# EAGLE design business_card_v1 (EAGLE 9.5.2)
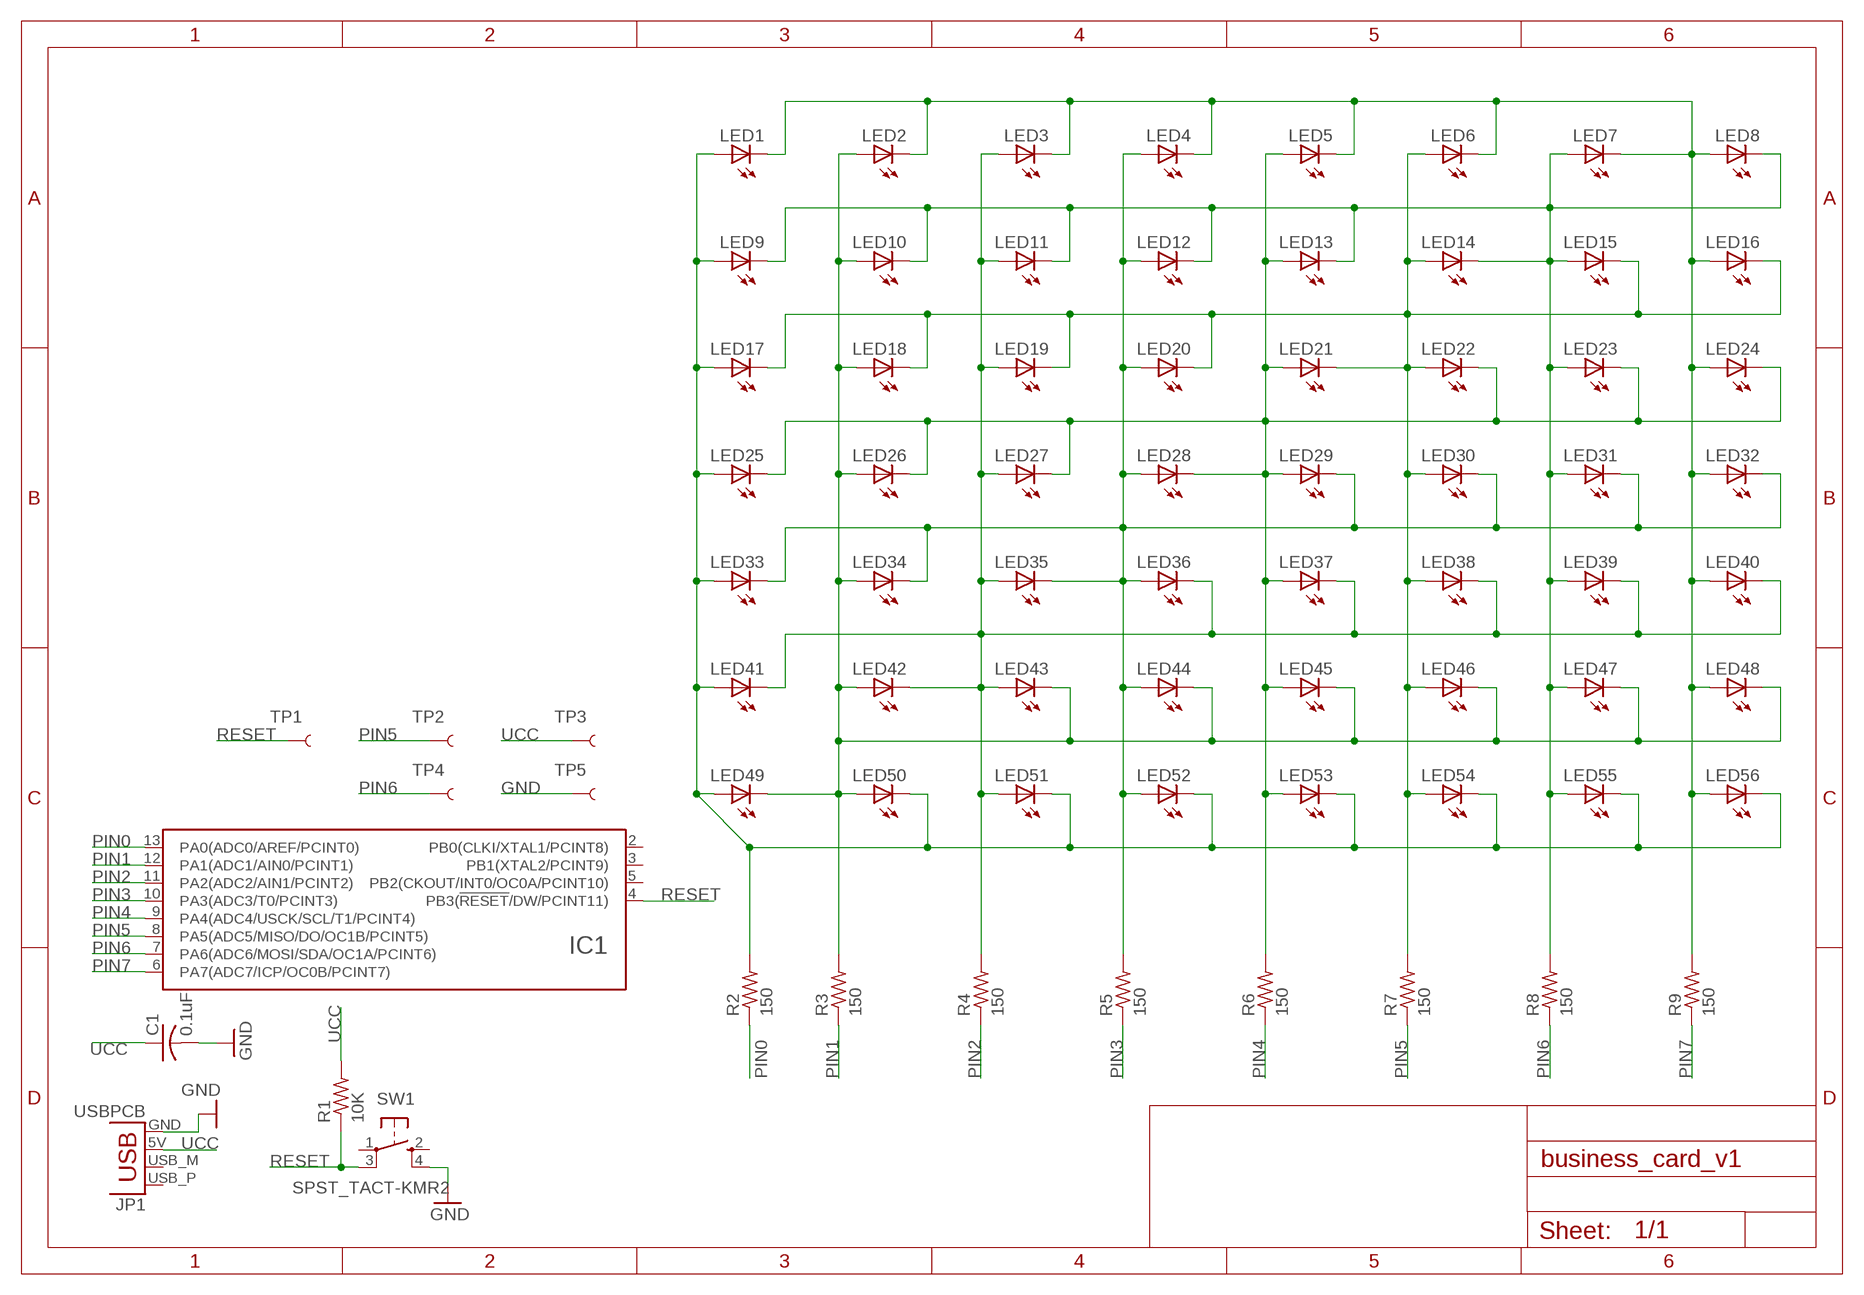
[diagram p0: schematic, sheet 1]

## Parts
C1  0.1uF  C-USC0603K  [C0603K]
IC1  ATTINY24/44/84-SSU  [SOIC14]
JP1  USBPCB  [USB-A-PCB]
LED1  LEDCHIPLED_0805  [CHIPLED_0805]
LED2  LEDCHIPLED_0805  [CHIPLED_0805]
LED3  LEDCHIPLED_0805  [CHIPLED_0805]
LED4  LEDCHIPLED_0805  [CHIPLED_0805]
LED5  LEDCHIPLED_0805  [CHIPLED_0805]
LED6  LEDCHIPLED_0805  [CHIPLED_0805]
LED7  LEDCHIPLED_0805  [CHIPLED_0805]
LED8  LEDCHIPLED_0805  [CHIPLED_0805]
LED9  LEDCHIPLED_0805  [CHIPLED_0805]
LED10  LEDCHIPLED_0805  [CHIPLED_0805]
LED11  LEDCHIPLED_0805  [CHIPLED_0805]
LED12  LEDCHIPLED_0805  [CHIPLED_0805]
LED13  LEDCHIPLED_0805  [CHIPLED_0805]
LED14  LEDCHIPLED_0805  [CHIPLED_0805]
LED15  LEDCHIPLED_0805  [CHIPLED_0805]
LED16  LEDCHIPLED_0805  [CHIPLED_0805]
LED17  LEDCHIPLED_0805  [CHIPLED_0805]
LED18  LEDCHIPLED_0805  [CHIPLED_0805]
LED19  LEDCHIPLED_0805  [CHIPLED_0805]
LED20  LEDCHIPLED_0805  [CHIPLED_0805]
LED21  LEDCHIPLED_0805  [CHIPLED_0805]
LED22  LEDCHIPLED_0805  [CHIPLED_0805]
LED23  LEDCHIPLED_0805  [CHIPLED_0805]
LED24  LEDCHIPLED_0805  [CHIPLED_0805]
LED25  LEDCHIPLED_0805  [CHIPLED_0805]
LED26  LEDCHIPLED_0805  [CHIPLED_0805]
LED27  LEDCHIPLED_0805  [CHIPLED_0805]
LED28  LEDCHIPLED_0805  [CHIPLED_0805]
LED29  LEDCHIPLED_0805  [CHIPLED_0805]
LED30  LEDCHIPLED_0805  [CHIPLED_0805]
LED31  LEDCHIPLED_0805  [CHIPLED_0805]
LED32  LEDCHIPLED_0805  [CHIPLED_0805]
LED33  LEDCHIPLED_0805  [CHIPLED_0805]
LED34  LEDCHIPLED_0805  [CHIPLED_0805]
LED35  LEDCHIPLED_0805  [CHIPLED_0805]
LED36  LEDCHIPLED_0805  [CHIPLED_0805]
LED37  LEDCHIPLED_0805  [CHIPLED_0805]
LED38  LEDCHIPLED_0805  [CHIPLED_0805]
LED39  LEDCHIPLED_0805  [CHIPLED_0805]
LED40  LEDCHIPLED_0805  [CHIPLED_0805]
LED41  LEDCHIPLED_0805  [CHIPLED_0805]
LED42  LEDCHIPLED_0805  [CHIPLED_0805]
LED43  LEDCHIPLED_0805  [CHIPLED_0805]
LED44  LEDCHIPLED_0805  [CHIPLED_0805]
LED45  LEDCHIPLED_0805  [CHIPLED_0805]
LED46  LEDCHIPLED_0805  [CHIPLED_0805]
LED47  LEDCHIPLED_0805  [CHIPLED_0805]
LED48  LEDCHIPLED_0805  [CHIPLED_0805]
LED49  LEDCHIPLED_0805  [CHIPLED_0805]
LED50  LEDCHIPLED_0805  [CHIPLED_0805]
LED51  LEDCHIPLED_0805  [CHIPLED_0805]
LED52  LEDCHIPLED_0805  [CHIPLED_0805]
LED53  LEDCHIPLED_0805  [CHIPLED_0805]
LED54  LEDCHIPLED_0805  [CHIPLED_0805]
LED55  LEDCHIPLED_0805  [CHIPLED_0805]
LED56  LEDCHIPLED_0805  [CHIPLED_0805]
R1  10K  R-US_R0603  [R0603]
R2  150  R-US_R0603  [R0603]
R3  150  R-US_R0603  [R0603]
R4  150  R-US_R0603  [R0603]
R5  150  R-US_R0603  [R0603]
R6  150  R-US_R0603  [R0603]
R7  150  R-US_R0603  [R0603]
R8  150  R-US_R0603  [R0603]
R9  150  R-US_R0603  [R0603]
SW1  SPST_TACT-KMR2  [KMR2]
TP1  TEST-POINTPOGO_PTH  [1X01_NO_SILK]
TP2  TEST-POINTPOGO_PTH  [1X01_NO_SILK]
TP3  TEST-POINTPOGO_PTH  [1X01_NO_SILK]
TP4  TEST-POINTPOGO_PTH  [1X01_NO_SILK]
TP5  TEST-POINTPOGO_PTH  [1X01_NO_SILK]

## Nets
GND: C1.2 JP1.GND SW1.4(S1) TP5.1
N$1: LED1.A LED9.A LED17.A LED25.A LED33.A LED41.A LED49.A LED50.C LED51.C LED52.C LED53.C LED54.C LED55.C LED56.C R2.2
N$2: LED2.A LED10.A LED18.A LED26.A LED34.A LED42.A LED43.C LED44.C LED45.C LED46.C LED47.C LED48.C LED49.C LED50.A R3.2
N$3: LED3.A LED11.A LED19.A LED27.A LED35.A LED36.C LED37.C LED38.C LED39.C LED40.C LED41.C LED42.C LED43.A LED51.A R4.2
N$4: LED4.A LED12.A LED20.A LED28.A LED29.C LED30.C LED31.C LED32.C LED33.C LED34.C LED35.C LED36.A LED44.A LED52.A R5.2
N$8: LED1.C LED2.C LED3.C LED4.C LED5.C LED6.C LED7.C LED8.A LED16.A LED24.A LED32.A LED40.A LED48.A LED56.A R9.2
N$15: LED7.A LED8.C LED9.C LED10.C LED11.C LED12.C LED13.C LED14.C LED15.A LED23.A LED31.A LED39.A LED47.A LED55.A R8.2
N$31: LED6.A LED14.A LED15.C LED16.C LED17.C LED18.C LED19.C LED20.C LED21.C LED22.A LED30.A LED38.A LED46.A LED54.A R7.2
N$34: LED5.A LED13.A LED21.A LED22.C LED23.C LED24.C LED25.C LED26.C LED27.C LED28.C LED29.A LED37.A LED45.A LED53.A R6.2
PIN0: IC1.13(PA0(ADC0/AREF/PCINT0)) R2.1
PIN1: IC1.12(PA1(ADC1/AIN0/PCINT1)) R3.1
PIN2: IC1.11(PA2(ADC2/AIN1/PCINT2)) R4.1
PIN3: IC1.10(PA3(ADC3/T0/PCINT3)) R5.1
PIN4: IC1.9(PA4(ADC4/USCK/SCL/T1/PCINT4)) R6.1
PIN5: IC1.8(PA5(ADC5/MISO/DO/OC1B/PCINT5)) R7.1 TP2.1
PIN6: IC1.7(PA6(ADC6/MOSI/SDA/OC1A/PCINT6)) R8.1 TP4.1
PIN7: IC1.6(PA7(ADC7/ICP/OC0B/PCINT7)) R9.1
RESET: IC1.4(PB3(!RESET!/DW/PCINT11)) R1.1 SW1.3(P1) TP1.1
UCC: C1.1 JP1.5V(VBUS) R1.2 TP3.1
Unconnected: IC1.2(PB0(CLKI/XTAL1/PCINT8)) IC1.3(PB1(XTAL2/PCINT9)) IC1.5(PB2(CKOUT/INT0/OC0A/PCINT10)) JP1.USB_M(D-) JP1.USB_P(D+) SW1.1(P) SW1.2(S)

## Power pins joined to a net without a drawn wire
GND: IC1.14(GND)
UCC: IC1.1(UCC)

## Library data of the parts
C1 = adafruit:C-US: CAPACITOR, American symbol
IC1 = atmel_tiny24-44-84tiny48-88mega48-88-168-328:ATTINY24/44/84
JP1 = SparkFun-Connectors:USB: USB Connectors USB-B-PTH is fully proven SKU : PRT-00139/CONN-08278 USB-miniB is fully proven SKU : PRT-00587 USB-A-PCB is untested. USB-A-H is throughly reviewed, but untested. Spark Fun Electronics SKU : PRT-00437 USB-B-SMT is throughly reviewed, but untested. Needs silkscreen touching up. USB-A-S has not been used/tested USB-MB-H has not been used/tested USB-MICROB has been used. CONN-09505
LED1-LED56 = led:LED: LED OSRAM: - CHIPLED LG R971, LG N971, LY N971, LG Q971, LY Q971, LO R971, LY R971 LH N974, LH R974 LS Q976, LO Q976, LY Q976 LO Q996 - Hyper CHIPLED LW Q18S LB Q993, LB Q99A, LB R99A - SideLED LS A670, LO A670, LY A670, LG A670, LP A670 LB A673, LV A673, LT A673, LW A673 LH A674 LY A675 LS A676, LA A676, LO A676, LY A676, LW A676 LS A679, LY A679, LG A679 - Hyper Micro SIDELED® LS Y876, LA Y876, LO Y876, LY Y876 LT Y87S - SmartLED LW L88C, LW L88S LB L89C, LB L89S, LG L890 LS L89K, LO L89K, LY L89K LS L896, LA L896, LO L896, LY L896 - TOPLED LS T670, LO T670, LY T670, LG T670, LP T670 LSG T670, LSP T670, LSY T670, LOP T670, LYG T670 LG T671, LOG T671, LSG T671 LB T673, LV T673, LT T673, LW T673 LH T674 LS T676, LA T676, LO T676, LY T676, LB T676, LH T676, LSB T676, LW T676 LB T67C, LV T67C, LT T67C, LS T67K, LO T67K, LY T67K, LW E67C LS E67B, LA E67B, LO E67B, LY E67B, LB E67C, LV E67C, LT E67C LW T67C LS T679, LY T679, LG T679 LS T770, LO T770, LY T770, LG T770, LP T770 LB T773, LV T773, LT T773, LW T773 LH T774 LS E675, LA E675, LY E675, LS T675 LS T776, LA T776, LO T776, LY T776, LB T776 LHGB T686 LT T68C, LB T68C - Hyper Mini TOPLED® LB M676 - Mini TOPLED Santana® LG M470 LS M47K, LO M47K, LY M47K Source: http://www.osram.convergy.de LUXEON: - LUMILED® LXK2-PW12-R00, LXK2-PW12-S00, LXK2-PW14-U00, LXK2-PW14-V00 LXK2-PM12-R00, LXK2-PM12-S00, LXK2-PM14-U00 LXK2-PE12-Q00, LXK2-PE12-R00, LXK2-PE12-S00, LXK2-PE14-T00, LXK2-PE14-U00 LXK2-PB12-K00, LXK2-PB12-L00, LXK2-PB12-M00, LXK2-PB14-N00, LXK2-PB14-P00, LXK2-PB14-Q00 LXK2-PR12-L00, LXK2-PR12-M00, LXK2-PR14-Q00, LXK2-PR14-R00 LXK2-PD12-Q00, LXK2-PD12-R00, LXK2-PD12-S00 LXK2-PH12-R00, LXK2-PH12-S00 LXK2-PL12-P00, LXK2-PL12-Q00, LXK2-PL12-R00 Source: www.luxeon.com KINGBRIGHT: KA-3528ASYC Source: www.kingbright.com
R1-R9 = resistor:R-US_: RESISTOR, American symbol
SW1 = adafruit:SPST_TACT: SMT 6mm switch, EVQQ2 series http://www.ladyada.net/library/eagle
TP1-TP5 = SparkFun-Connectors:TEST-POINT: SparkFun Test Points Bare copper test points for troubleshooting or In-Circuit-Testing. These are used by our Production team for verifying production board runs using pogo-pins on test beds. SparkFun Products: SparkFun LSM9DS1 Breakout <https://www.sparkfun.com/products/13284> SparkFun PSOC <https://www.sparkfun.com/products/13714> SparkFun Load Cell Amplifier <https://www.sparkfun.com/products/13879>

## Board
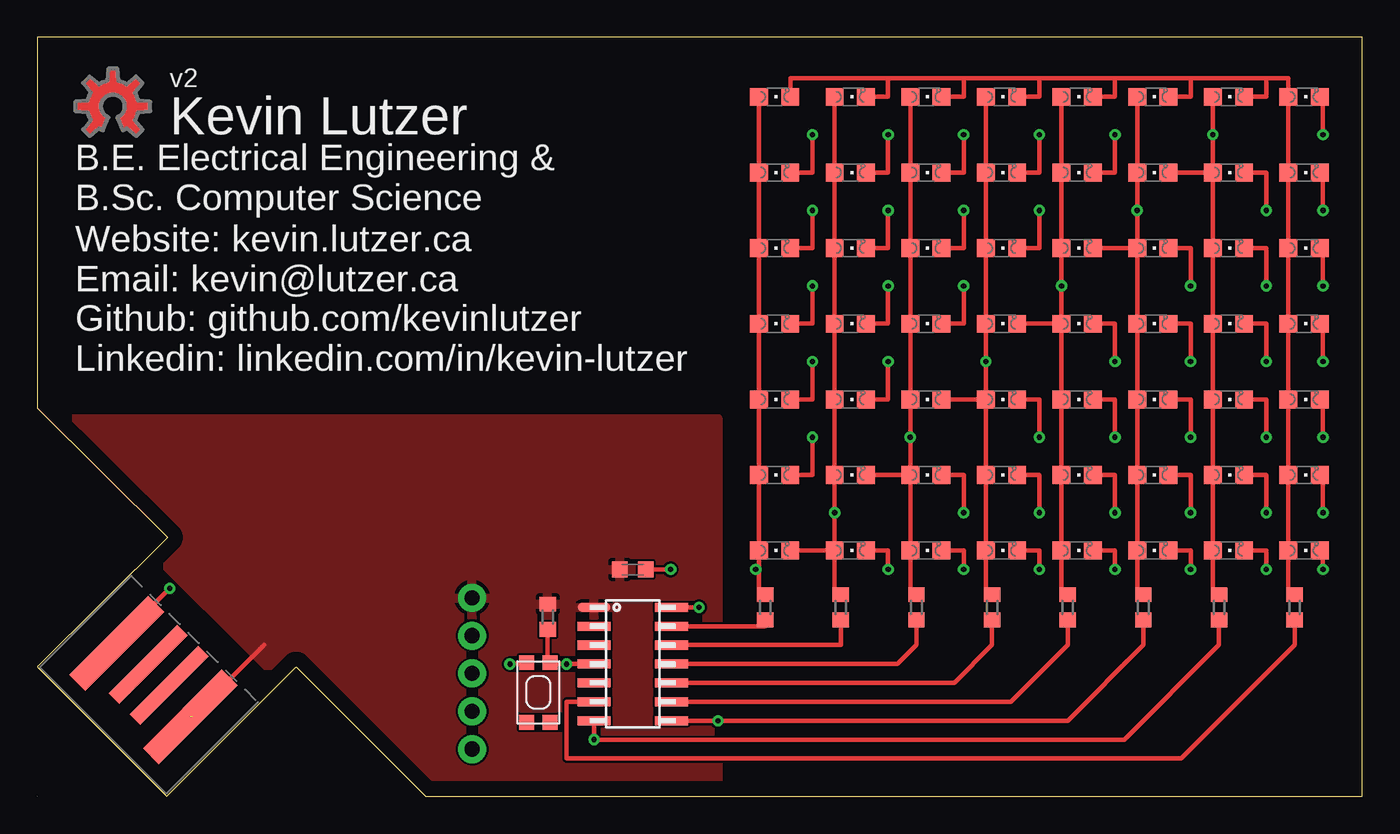
[diagram p1: board, top side]
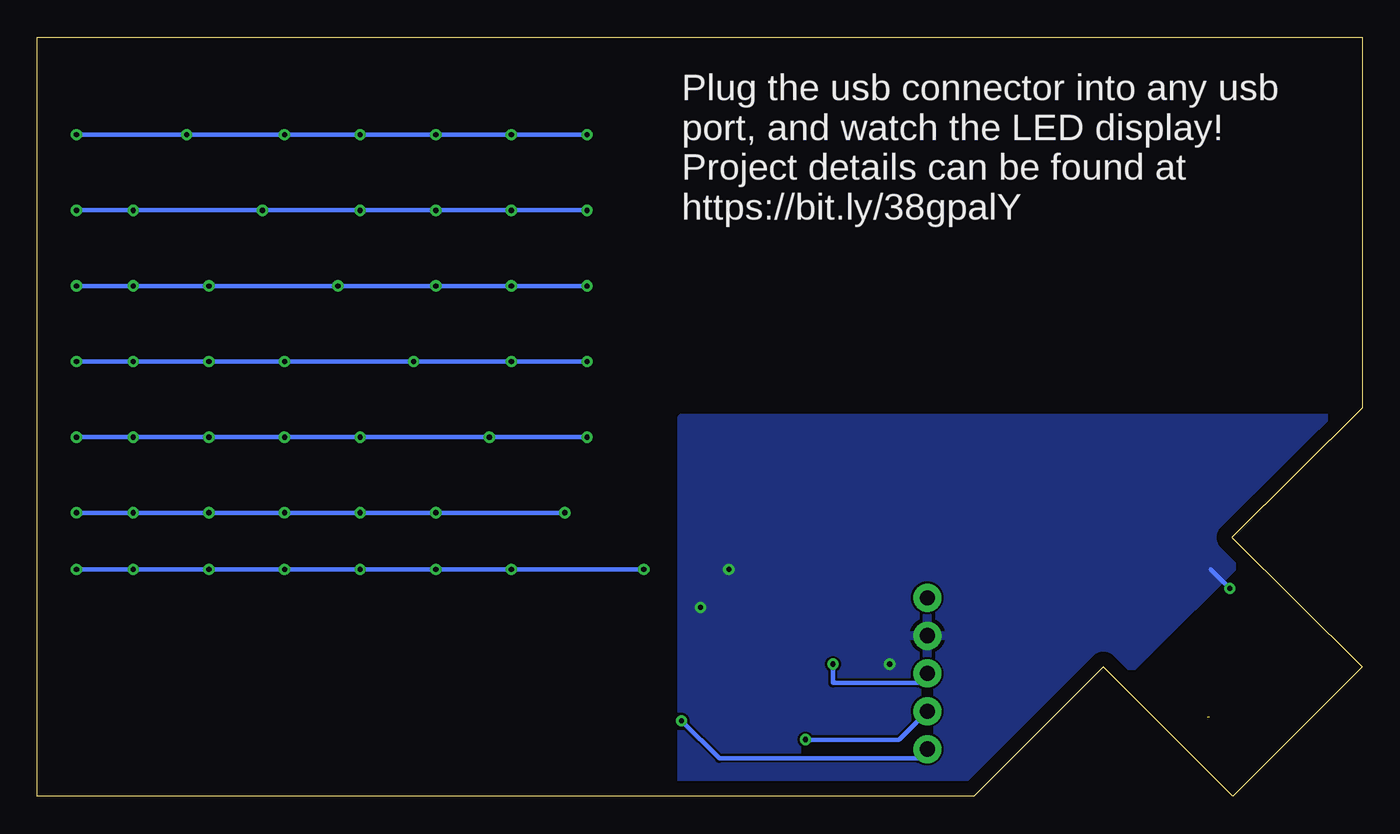
[diagram p2: board, bottom side, seen from below]

Size 89 x 51 mm. Coordinates in mm from the lower left corner, seen from the top.
Outline: 0,51 0,26.09 8.77,17.39 0,8.7 8.7,0 17.39,8.7 26.09,0 89,0 89,51 0,51
Copper layers (1*16): Top 0.035mm / dielectric 1.5mm / Bottom 0.035mm
Design rules "default": minimum track width 6mil, minimum drill 0.35mm, track to track 6mil, track to pad 6mil, pad to pad 6mil, via to via 6mil, smd to smd 6mil, copper to edge 40mil, drill to drill 6mil, minimum pad ring 10mil, minimum via ring 8mil, stop-mask expansion 4mil, vias tented up to drill 0mil, thermal gap 10mil

### Footprints (pad centres in the part's own frame; a part is rotated, then mirrored left to right if it is on the bottom)
C0603K = smd 1.05 x 1.08: 1 -0.875,0; 2 0.875,0
SOIC14 = smd 0.61 x 2.21: 1 -3.81,-2.603; 2 -2.54,-2.603; 3 -1.27,-2.603; 4 0,-2.603; 5 1.27,-2.603; 6 2.54,-2.603; 7 3.81,-2.603; 8 3.81,2.603; 9 2.54,2.603; 10 1.27,2.603; 11 0,2.603; 12 -1.27,2.603; 13 -2.54,2.603; 14 -3.81,2.603
USB-A-PCB = smd 7.5 x 1.5: 5V -0.2,-3.5; GND -0.2,3.5 | smd 6.5 x 1: USB_M 0.3,-1; USB_P 0.3,1
CHIPLED_0805 = smd 1.2 x 1.2: A 0,-1.05; C 0,1.05
R0603 = smd 1 x 1.1: 1 -0.85,0; 2 0.85,0
KMR2 = smd 1 x 1: 1 2,0.8; 2 2,-0.8; 3 -2,0.8; 4 -2,-0.8
1X01_NO_SILK = drill 1.016 pad 1.88: 1 0,0

### Placement (x,y rotation side)
C1  40.01,15.24 0 top
IC1  40.01,8.89 270 top
JP1  7.95,7.95 45 top
LED1  49.53,46.99 270 top
LED2  54.61,46.99 270 top
LED3  59.69,46.99 270 top
LED4  64.77,46.99 270 top
LED5  69.85,46.99 270 top
LED6  74.93,46.99 270 top
LED7  80.01,46.99 270 top
LED8  85.09,46.99 270 top
LED9  49.53,41.91 270 top
LED10  54.61,41.91 270 top
LED11  59.69,41.91 270 top
LED12  64.77,41.91 270 top
LED13  69.85,41.91 270 top
LED14  74.93,41.91 270 top
LED15  80.01,41.91 270 top
LED16  85.09,41.91 270 top
LED17  49.53,36.83 270 top
LED18  54.61,36.83 270 top
LED19  59.69,36.83 270 top
LED20  64.77,36.83 270 top
LED21  69.85,36.83 270 top
LED22  74.93,36.83 270 top
LED23  80.01,36.83 270 top
LED24  85.09,36.83 270 top
LED25  49.53,31.75 270 top
LED26  54.61,31.75 270 top
LED27  59.69,31.75 270 top
LED28  64.77,31.75 270 top
LED29  69.85,31.75 270 top
LED30  74.93,31.75 270 top
LED31  80.01,31.75 270 top
LED32  85.09,31.75 270 top
LED33  49.53,26.67 270 top
LED34  54.61,26.67 270 top
LED35  59.69,26.67 270 top
LED36  64.77,26.67 270 top
LED37  69.85,26.67 270 top
LED38  74.93,26.67 270 top
LED39  80.01,26.67 270 top
LED40  85.09,26.67 270 top
LED41  49.53,21.59 270 top
LED42  54.61,21.59 270 top
LED43  59.69,21.59 270 top
LED44  64.77,21.59 270 top
LED45  69.85,21.59 270 top
LED46  74.93,21.59 270 top
LED47  80.01,21.59 270 top
LED48  85.09,21.59 270 top
LED49  49.53,16.51 270 top
LED50  54.61,16.51 270 top
LED51  59.69,16.51 270 top
LED52  64.77,16.51 270 top
LED53  69.85,16.51 270 top
LED54  74.93,16.51 270 top
LED55  80.01,16.51 270 top
LED56  85.09,16.51 270 top
R1  34.29,12.06 90 top
R2  48.9,12.7 90 top
R3  53.98,12.7 90 top
R4  59.05,12.7 90 top
R5  64.14,12.7 90 top
R6  69.22,12.7 90 top
R7  74.3,12.7 90 top
R8  79.38,12.7 90 top
R9  84.45,12.7 90 top
SW1  33.66,6.99 270 top
TP1  29.21,8.26 0 top
TP2  29.21,3.17 0 top
TP3  29.21,13.34 0 top
TP4  29.21,5.71 0 top
TP5  29.21,10.79 0 top
U$1  [OSHWLOGO_TOP_0.2]  5.08,46.35 0 top

### Tracks (layer width: path | path; a pad name or v marks a point on that pad's centre or on a via)
GND  (via drill 0.35)
  Top 0.305: SW1.4 32.76,8.89 v31.75,8.89 | C1.2 v42.55,15.24 | IC1.14 v44.45,12.7 | 5.33,10.41 v8.89,13.97
  Top 0.813: 5.33,10.41 JP1.GND
  Bottom 0.305: v8.89,13.97 10.16,15.24
  pour Bottom: -1.27,25.4 45.72,25.4 45.72,0 24.13,0
N$1  (via drill 0.35)
  Top 0.305: LED41.A LED49.A 48.48,15.24 | LED41.A LED25.A | LED1.A LED9.A LED25.A | 48.48,15.24 v48.26,15.24 | LED50.C 57.15,16.51 v57.15,15.24 | LED51.C 62.23,16.51 v62.23,15.24 | LED52.C 67.31,16.51 v67.31,15.24 | LED53.C 72.39,16.51 v72.39,15.24 | LED54.C 77.47,16.51 v77.47,15.24 | LED55.C 82.55,16.51 v82.55,15.24 | R2.2 48.48,13.55 48.48,15.24 | LED33.A LED41.A | LED17.A LED25.A | LED56.C 86.36,16.29 v86.36,15.24
  Bottom 0.305: v86.36,15.24 v82.55,15.24 v77.47,15.24 v72.39,15.24 v67.31,15.24 v62.23,15.24 v57.15,15.24 v48.26,15.24
N$2  (via drill 0.35)
  Top 0.305: LED50.A v53.56,19.05 LED42.A LED26.A | v86.36,19.05 86.36,21.59 LED48.C | LED49.C LED50.A | LED43.C 62.23,21.59 v62.23,19.05 | LED44.C 67.31,21.59 v67.31,19.05 | LED45.C 72.39,21.59 v72.39,19.05 | LED46.C 77.47,21.59 v77.47,19.05 | LED47.C 82.55,21.59 v82.55,19.05 | LED50.A 53.56,13.55 R3.2 | LED2.A LED10.A LED18.A LED26.A | LED34.A LED26.A
  Bottom 0.305: v53.56,19.05 v62.23,19.05 v67.31,19.05 v72.39,19.05 v77.47,19.05 v82.55,19.05 v86.36,19.05
N$3  (via drill 0.35)
  Top 0.305: LED43.A LED51.A 58.64,13.55 R4.2 | LED35.A v58.64,24.13 LED43.A | LED35.A LED19.A | LED19.A LED3.A | LED41.C 52.07,21.59 v52.07,24.13 | v86.36,24.13 86.36,26.67 LED40.C | LED36.C 67.31,26.67 v67.31,24.13 | LED37.C 72.39,26.67 v72.39,24.13 | LED38.C 77.47,26.67 v77.47,24.13 | LED39.C 82.55,26.67 v82.55,24.13 | LED42.C LED43.A | LED11.A LED19.A | LED35.A LED43.A | LED27.A LED35.A
  Bottom 0.305: v52.07,24.13 v58.64,24.13 v67.31,24.13 v72.39,24.13 v77.47,24.13 v82.55,24.13 v86.36,24.13
N$4  (via drill 0.35)
  Top 0.305: LED4.A LED20.A | LED20.A v63.72,29.21 LED36.A | LED36.A LED52.A | LED33.C 52.07,26.67 v52.07,29.21 | v86.36,29.21 86.36,31.75 LED32.C | LED31.C 82.55,31.75 v82.55,29.21 | LED30.C 77.47,31.75 v77.47,29.21 | LED29.C 72.39,31.75 v72.39,29.21 | LED52.A 63.72,13.55 R5.2 | LED34.C 57.15,26.67 v57.15,29.21 | LED35.C LED36.A | LED28.A LED36.A | LED12.A LED20.A | LED44.A LED52.A
  Bottom 0.305: v52.07,29.21 v57.15,29.21 v63.72,29.21 v72.39,29.21 v77.47,29.21 v82.55,29.21 v86.36,29.21
N$8
  Top 0.305: LED56.A LED40.A LED32.A LED24.A LED16.A LED8.A 84.04,48.26 82.55,48.26 | LED1.C 50.58,48.26 57.15,48.26 | 82.55,48.26 77.47,48.26 | 77.47,48.26 72.39,48.26 | 72.39,48.26 67.31,48.26 | 67.31,48.26 62.23,48.26 | 62.23,48.26 57.15,48.26 | LED2.C 57.15,46.99 57.15,48.26 | LED3.C 62.23,46.99 62.23,48.26 | LED4.C 67.31,46.99 67.31,48.26 | LED5.C 72.39,46.99 72.39,48.26 | LED6.C 77.47,46.99 77.47,48.26 | LED7.C 82.55,46.99 82.55,48.26 | LED56.A 84.04,13.55 R9.2 | LED48.A LED56.A
N$15  (via drill 0.35)
  Top 0.305: LED31.A LED15.A | LED7.A v78.96,44.45 LED15.A | LED9.C 52.07,41.91 v52.07,44.45 | v86.36,44.45 86.36,46.99 LED8.C | LED10.C 57.15,41.91 v57.15,44.45 | LED11.C 62.23,41.91 v62.23,44.45 | LED12.C 67.31,41.91 v67.31,44.45 | LED13.C 72.39,41.91 v72.39,44.45 | LED14.C LED15.A | R8.2 78.96,13.55 LED55.A LED47.A LED39.A LED31.A | LED23.A LED31.A
  Bottom 0.305: v52.07,44.45 v57.15,44.45 v62.23,44.45 v67.31,44.45 v72.39,44.45 v78.96,44.45 v86.36,44.45
N$31  (via drill 0.35)
  Top 0.305: LED54.A LED38.A LED30.A LED22.A | LED17.C 52.07,36.83 v52.07,39.37 | v86.36,39.37 86.36,41.91 LED16.C | LED15.C 82.55,41.91 v82.55,39.37 | LED18.C 57.15,36.83 v57.15,39.37 | LED19.C 62.23,36.83 v62.23,39.37 | LED20.C 67.31,36.83 v67.31,39.37 | LED21.C LED22.A | LED54.A 73.88,13.55 R7.2 | LED6.A v73.88,39.37 LED22.A | LED14.A LED22.A | LED46.A LED54.A
  Bottom 0.305: v52.07,39.37 v57.15,39.37 v62.23,39.37 v67.31,39.37 v73.88,39.37 v82.55,39.37 v86.36,39.37
N$34  (via drill 0.35)
  Top 0.305: LED53.A LED37.A LED29.A | LED21.A v68.8,34.29 LED29.A | LED21.A LED5.A | LED25.C 52.07,31.75 v52.07,34.29 | v86.36,34.29 86.36,36.83 LED24.C | LED23.C 82.55,36.83 v82.55,34.29 | LED22.C 77.47,36.83 v77.47,34.29 | LED53.A 68.8,13.55 R6.2 | LED27.C 62.23,31.75 v62.23,34.29 | LED28.C LED29.A | LED26.C 57.15,31.75 v57.15,34.29 | LED21.A LED29.A | LED45.A LED53.A | LED13.A LED21.A
  Bottom 0.305: v52.07,34.29 v57.15,34.29 v62.23,34.29 v68.8,34.29 v77.47,34.29 v82.55,34.29 v86.36,34.29
PIN0
  Top 0.305: IC1.13 48.9,11.43 R2.1
PIN1
  Top 0.305: IC1.12 53.98,10.16 R3.1
PIN2
  Top 0.305: IC1.11 57.78,8.89 59.05,10.16 R4.1
PIN3
  Top 0.305: IC1.10 61.59,7.62 64.14,10.16 R5.1
PIN4
  Top 0.305: IC1.9 65.41,6.35 69.22,10.16 R6.1
PIN5  (via drill 0.35)
  Top 0.305: IC1.8 v45.72,5.08 69.22,5.08 74.3,10.16 R7.1
  Bottom 0.305: v45.72,5.08 43.18,2.54 29.84,2.54 TP2.1
PIN6  (via drill 0.35)
  Top 0.305: IC1.7 v37.4,3.81 73.03,3.81 79.38,10.16 R8.1
  Bottom 0.305: v37.4,3.81 31.11,3.81 TP4.1
PIN7
  Top 0.305: IC1.6 35.56,6.35 35.56,2.54 76.83,2.54 84.45,10.16 R9.1
RESET  (via drill 0.35)
  Top 0.305: IC1.4 v35.56,8.89 34.55,8.89 SW1.3 34.29,9.15 R1.1
  Bottom 0.305: v35.56,8.89 35.56,7.62 29.84,7.62 TP1.1
UCC  (1 unrouted)
  Top 0.305: 10.41,5.33 15.24,10.16
  pour Top: -1.27,25.4 45.72,25.4 45.72,0 24.13,0

### Text on the board
tNames: v2 | Kevin Lutzer | B.E. Electrical Engineering & / B.Sc. Computer Science | Website: kevin.lutzer.ca / Email: kevin@lutzer.ca / Github: github.com/kevinlutzer / Linkedin: linkedin.com/in/kevin-lutzer
bNames: Plug the usb connector into any usb / port, and watch the LED display! / Project details can be found at / https://bit.ly/38gpalY